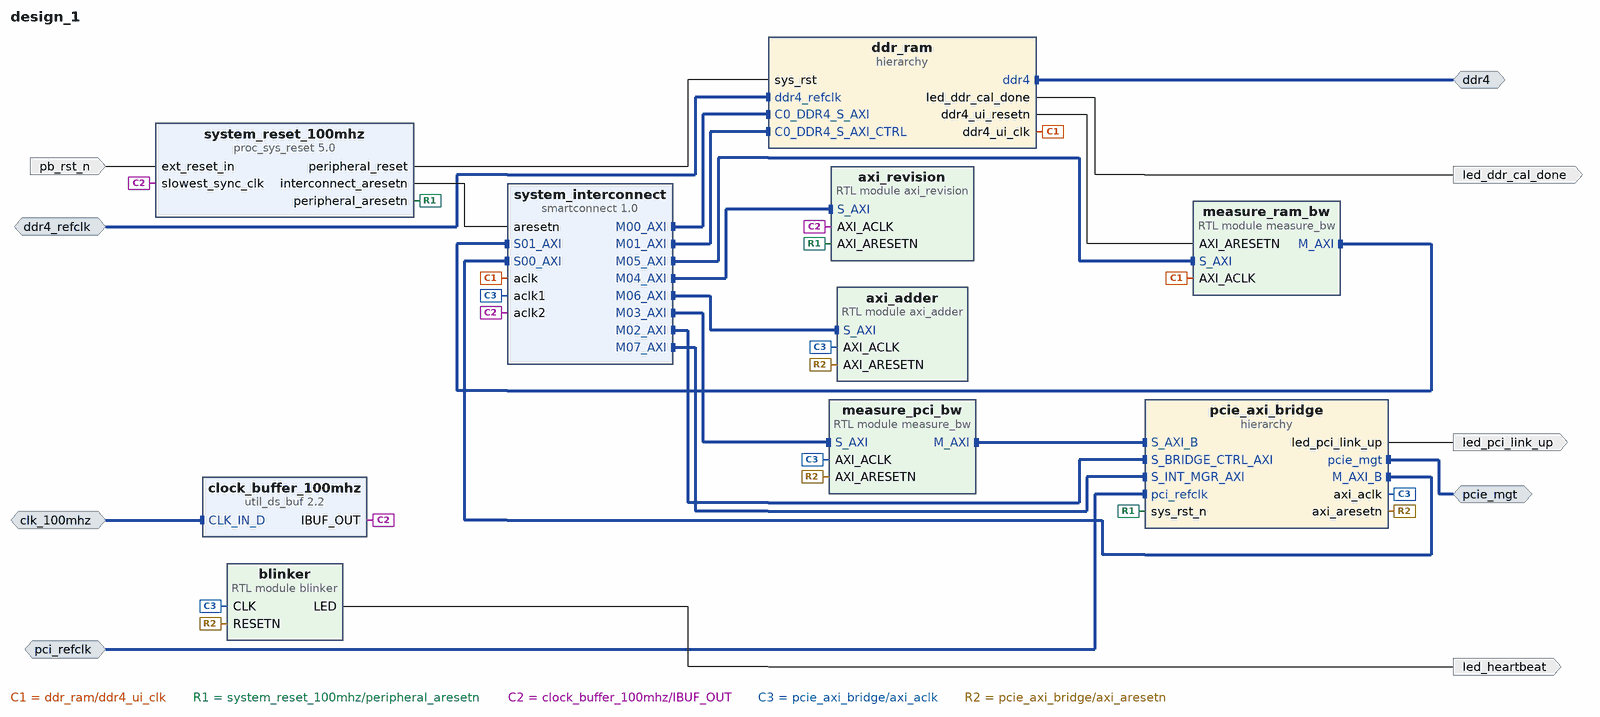
[diagram p0: block diagram of the top level]
# Vivado block design design_1, xczu19eg-ffvc1760-2-i, Vivado 2021.1
create_bd_design design_1

create_bd_intf_port -mode Master -vlnv xilinx.com:interface:ddr4_rtl:1.0 ddr4
create_bd_intf_port -mode Slave -vlnv xilinx.com:interface:diff_clock_rtl:1.0 ddr4_refclk
set_property -dict {CONFIG.FREQ_HZ 333000000} [get_bd_intf_ports ddr4_refclk]
create_bd_intf_port -mode Slave -vlnv xilinx.com:interface:diff_clock_rtl:1.0 clk_100mhz
create_bd_intf_port -mode Slave -vlnv xilinx.com:interface:diff_clock_rtl:1.0 pci_refclk
create_bd_intf_port -mode Master -vlnv xilinx.com:interface:pcie_7x_mgt_rtl:1.0 pcie_mgt
create_bd_port -dir I -type rst pb_rst_n
create_bd_port -dir O led_heartbeat
create_bd_port -dir O led_ddr_cal_done
create_bd_port -dir O led_pci_link_up

create_bd_cell -type ip -vlnv xilinx.com:ip:proc_sys_reset:5.0 system_reset_100mhz
create_bd_cell -type ip -vlnv xilinx.com:ip:util_ds_buf:2.2 clock_buffer_100mhz
create_bd_cell -type module -reference blinker blinker
create_bd_cell -type module -reference axi_revision axi_revision
create_bd_cell -type ip -vlnv xilinx.com:ip:smartconnect:1.0 system_interconnect
set_property -dict {CONFIG.NUM_CLKS 3 CONFIG.NUM_MI 8 CONFIG.NUM_SI 2} [get_bd_cells system_interconnect]
create_bd_cell -type module -reference measure_bw measure_pci_bw
create_bd_cell -type module -reference measure_bw measure_ram_bw
set_property -dict {CONFIG.ADDRESS_OFFSET 0x0000000800000000} [get_bd_cells measure_ram_bw]
create_bd_cell -type module -reference axi_adder axi_adder
create_bd_cell -type hier pcie_axi_bridge
create_bd_cell -type hier ddr_ram

# ---- hierarchy /pcie_axi_bridge ----
current_bd_instance /pcie_axi_bridge
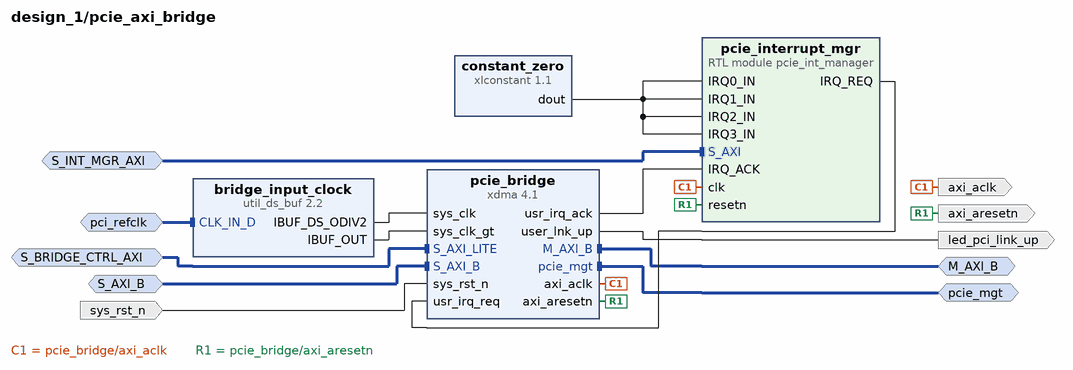
[diagram p1: block diagram inside /pcie_axi_bridge]
create_bd_intf_pin -mode Slave -vlnv xilinx.com:interface:aximm_rtl:1.0 S_BRIDGE_CTRL_AXI
create_bd_intf_pin -mode Slave -vlnv xilinx.com:interface:aximm_rtl:1.0 S_AXI_B
create_bd_intf_pin -mode Master -vlnv xilinx.com:interface:pcie_7x_mgt_rtl:1.0 pcie_mgt
create_bd_intf_pin -mode Master -vlnv xilinx.com:interface:aximm_rtl:1.0 M_AXI_B
create_bd_intf_pin -mode Slave -vlnv xilinx.com:interface:aximm_rtl:1.0 S_INT_MGR_AXI
create_bd_intf_pin -mode Slave -vlnv xilinx.com:interface:diff_clock_rtl:1.0 pci_refclk
create_bd_pin -dir O -type rst axi_aresetn
create_bd_pin -dir O -type clk axi_aclk
create_bd_pin -dir O led_pci_link_up
create_bd_pin -dir I -type rst sys_rst_n

create_bd_cell -type ip -vlnv xilinx.com:ip:xdma:4.1 pcie_bridge
set_property -dict [list \
  CONFIG.PF0_DEVICE_ID_mqdma 903F \
  CONFIG.PF0_SRIOV_VF_DEVICE_ID A03F \
  CONFIG.PF2_DEVICE_ID_mqdma 923F \
  CONFIG.PF3_DEVICE_ID_mqdma 933F \
  CONFIG.axi_addr_width 64 \
  CONFIG.axi_data_width 512_bit \
  CONFIG.axibar2pciebar_0 0x0 \
  CONFIG.axibar_num 1 \
  CONFIG.axilite_master_en true \
  CONFIG.axilite_master_size 8 \
  CONFIG.axisten_freq 250 \
  CONFIG.bridge_burst true \
  CONFIG.c_s_axi_supports_narrow_burst false \
  CONFIG.cfg_mgmt_if false \
  CONFIG.enable_jtag_dbg true \
  CONFIG.functional_mode AXI_Bridge \
  CONFIG.mode_selection Advanced \
  CONFIG.pcie_blk_locn X1Y0 \
  CONFIG.pcie_extended_tag false \
  CONFIG.pciebar2axibar_0 0x00000000 \
  CONFIG.pciebar2axibar_1 0x800000000 \
  CONFIG.pciebar2axibar_axil_master 0A0000000 \
  CONFIG.pf0_Use_Class_Code_Lookup_Assistant false \
  CONFIG.pf0_bar0_64bit false \
  CONFIG.pf0_bar0_scale Megabytes \
  CONFIG.pf0_bar0_size 1 \
  CONFIG.pf0_bar1_enabled true \
  CONFIG.pf0_bar1_scale Megabytes \
  CONFIG.pf0_bar1_size 1 \
  CONFIG.pf0_bar2_enabled false \
  CONFIG.pf0_base_class_menu Simple_communication_controllers \
  CONFIG.pf0_class_code_base 07 \
  CONFIG.pf0_class_code_interface 01 \
  CONFIG.pf0_class_code_sub 00 \
  CONFIG.pf0_device_id 903F \
  CONFIG.pf0_interrupt_pin INTA \
  CONFIG.pf0_msi_enabled false \
  CONFIG.pf0_sub_class_interface_menu 16450_compatible_serial_controller \
  CONFIG.pf0_subsystem_id 0007 \
  CONFIG.pl_link_cap_max_link_speed 8.0_GT/s \
  CONFIG.pl_link_cap_max_link_width X16 \
  CONFIG.plltype QPLL1 \
  CONFIG.xdma_num_usr_irq 1 \
  CONFIG.xdma_sts_ports false \
  CONFIG.xdma_wnum_rids 32 \
] [get_bd_cells pcie_bridge]
create_bd_cell -type ip -vlnv xilinx.com:ip:xlconstant:1.1 constant_zero
set_property -dict {CONFIG.CONST_VAL 0 CONFIG.CONST_WIDTH 1} [get_bd_cells constant_zero]
create_bd_cell -type ip -vlnv xilinx.com:ip:util_ds_buf:2.2 bridge_input_clock
set_property -dict {CONFIG.C_BUF_TYPE IBUFDSGTE} [get_bd_cells bridge_input_clock]
create_bd_cell -type module -reference pcie_int_manager pcie_interrupt_mgr

# ---- hierarchy /ddr_ram ----
current_bd_instance /ddr_ram
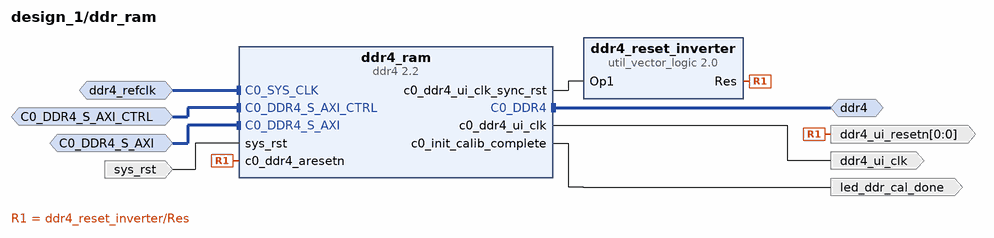
[diagram p2: block diagram inside /ddr_ram]
create_bd_intf_pin -mode Master -vlnv xilinx.com:interface:ddr4_rtl:1.0 ddr4
create_bd_intf_pin -mode Slave -vlnv xilinx.com:interface:diff_clock_rtl:1.0 ddr4_refclk
create_bd_intf_pin -mode Slave -vlnv xilinx.com:interface:aximm_rtl:1.0 C0_DDR4_S_AXI_CTRL
create_bd_intf_pin -mode Slave -vlnv xilinx.com:interface:aximm_rtl:1.0 C0_DDR4_S_AXI
create_bd_pin -dir O led_ddr_cal_done
create_bd_pin -dir O -type clk ddr4_ui_clk
create_bd_pin -dir I -type rst sys_rst
create_bd_pin -dir O -from 0 -to 0 ddr4_ui_resetn

create_bd_cell -type ip -vlnv xilinx.com:ip:ddr4:2.2 ddr4_ram
set_property -dict [list \
  CONFIG.C0.CKE_WIDTH 2 \
  CONFIG.C0.CK_WIDTH 2 \
  CONFIG.C0.CS_WIDTH 2 \
  CONFIG.C0.DDR4_AxiAddressWidth 34 \
  CONFIG.C0.DDR4_AxiDataWidth 512 \
  CONFIG.C0.DDR4_CasLatency 17 \
  CONFIG.C0.DDR4_CasWriteLatency 16 \
  CONFIG.C0.DDR4_CustomParts ../../../../../../ddr4/custom_parts_KSM24SED8.csv \
  CONFIG.C0.DDR4_DataMask NO_DM_NO_DBI \
  CONFIG.C0.DDR4_DataWidth 72 \
  CONFIG.C0.DDR4_InputClockPeriod 3001 \
  CONFIG.C0.DDR4_MemoryPart DDR4_CUSTOM \
  CONFIG.C0.DDR4_MemoryType SODIMMs \
  CONFIG.C0.DDR4_TimePeriod 938 \
  CONFIG.C0.DDR4_isCustom true \
  CONFIG.C0.ODT_WIDTH 2 \
] [get_bd_cells ddr4_ram]
create_bd_cell -type ip -vlnv xilinx.com:ip:util_vector_logic:2.0 ddr4_reset_inverter
set_property -dict {CONFIG.C_OPERATION not CONFIG.C_SIZE 1} [get_bd_cells ddr4_reset_inverter]

# ---- connections ----

current_bd_instance /pcie_axi_bridge
connect_bd_intf_net [get_bd_intf_pins S_BRIDGE_CTRL_AXI] [get_bd_intf_pins pcie_bridge/S_AXI_LITE]
connect_bd_intf_net [get_bd_intf_pins S_AXI_B] [get_bd_intf_pins pcie_bridge/S_AXI_B]
connect_bd_intf_net [get_bd_intf_pins pcie_mgt] [get_bd_intf_pins pcie_bridge/pcie_mgt]
connect_bd_intf_net [get_bd_intf_pins M_AXI_B] [get_bd_intf_pins pcie_bridge/M_AXI_B]
connect_bd_intf_net [get_bd_intf_pins S_INT_MGR_AXI] [get_bd_intf_pins pcie_interrupt_mgr/S_AXI]
connect_bd_intf_net [get_bd_intf_pins pci_refclk] [get_bd_intf_pins bridge_input_clock/CLK_IN_D]
connect_bd_net -net IRQ1_IN_1 [get_bd_pins constant_zero/dout] \
  [get_bd_pins pcie_interrupt_mgr/IRQ0_IN] [get_bd_pins pcie_interrupt_mgr/IRQ1_IN] [get_bd_pins pcie_interrupt_mgr/IRQ2_IN] \
  [get_bd_pins pcie_interrupt_mgr/IRQ3_IN]
connect_bd_net [get_bd_pins bridge_input_clock/IBUF_DS_ODIV2] [get_bd_pins pcie_bridge/sys_clk]
connect_bd_net [get_bd_pins bridge_input_clock/IBUF_OUT] [get_bd_pins pcie_bridge/sys_clk_gt]
connect_bd_net [get_bd_pins pcie_bridge/axi_aclk] [get_bd_pins axi_aclk] [get_bd_pins pcie_interrupt_mgr/clk]
connect_bd_net [get_bd_pins pcie_bridge/axi_aresetn] [get_bd_pins axi_aresetn] [get_bd_pins pcie_interrupt_mgr/resetn]
connect_bd_net [get_bd_pins pcie_bridge/user_lnk_up] [get_bd_pins led_pci_link_up]
connect_bd_net [get_bd_pins pcie_bridge/usr_irq_ack] [get_bd_pins pcie_interrupt_mgr/IRQ_ACK]
connect_bd_net [get_bd_pins pcie_interrupt_mgr/IRQ_REQ] [get_bd_pins pcie_bridge/usr_irq_req]
connect_bd_net [get_bd_pins sys_rst_n] [get_bd_pins pcie_bridge/sys_rst_n]

current_bd_instance /ddr_ram
connect_bd_intf_net [get_bd_intf_pins ddr4] [get_bd_intf_pins ddr4_ram/C0_DDR4]
connect_bd_intf_net [get_bd_intf_pins ddr4_refclk] [get_bd_intf_pins ddr4_ram/C0_SYS_CLK]
connect_bd_intf_net [get_bd_intf_pins C0_DDR4_S_AXI_CTRL] [get_bd_intf_pins ddr4_ram/C0_DDR4_S_AXI_CTRL]
connect_bd_intf_net [get_bd_intf_pins C0_DDR4_S_AXI] [get_bd_intf_pins ddr4_ram/C0_DDR4_S_AXI]
connect_bd_net [get_bd_pins ddr4_ram/c0_ddr4_ui_clk] [get_bd_pins ddr4_ui_clk]
connect_bd_net [get_bd_pins ddr4_ram/c0_ddr4_ui_clk_sync_rst] [get_bd_pins ddr4_reset_inverter/Op1]
connect_bd_net [get_bd_pins ddr4_ram/c0_init_calib_complete] [get_bd_pins led_ddr_cal_done]
connect_bd_net [get_bd_pins ddr4_reset_inverter/Res] [get_bd_pins ddr4_ram/c0_ddr4_aresetn] [get_bd_pins ddr4_ui_resetn]
connect_bd_net [get_bd_pins sys_rst] [get_bd_pins ddr4_ram/sys_rst]

current_bd_instance /
connect_bd_intf_net -intf_net CLK_IN_D_0_1 [get_bd_intf_ports clk_100mhz] [get_bd_intf_pins clock_buffer_100mhz/CLK_IN_D]
connect_bd_intf_net [get_bd_intf_ports ddr4_refclk] [get_bd_intf_pins ddr_ram/ddr4_refclk]
connect_bd_intf_net [get_bd_intf_ports ddr4] [get_bd_intf_pins ddr_ram/ddr4]
connect_bd_intf_net [get_bd_intf_pins measure_pci_bw/M_AXI] [get_bd_intf_pins pcie_axi_bridge/S_AXI_B]
connect_bd_intf_net [get_bd_intf_pins measure_ram_bw/M_AXI] [get_bd_intf_pins system_interconnect/S01_AXI]
connect_bd_intf_net [get_bd_intf_ports pci_refclk] [get_bd_intf_pins pcie_axi_bridge/pci_refclk]
connect_bd_intf_net [get_bd_intf_pins system_interconnect/S00_AXI] [get_bd_intf_pins pcie_axi_bridge/M_AXI_B]
connect_bd_intf_net [get_bd_intf_ports pcie_mgt] [get_bd_intf_pins pcie_axi_bridge/pcie_mgt]
connect_bd_intf_net -intf_net smartconnect_0_M03_AXI [get_bd_intf_pins measure_pci_bw/S_AXI] [get_bd_intf_pins system_interconnect/M03_AXI]
connect_bd_intf_net -intf_net smartconnect_0_M04_AXI [get_bd_intf_pins axi_revision/S_AXI] [get_bd_intf_pins system_interconnect/M04_AXI]
connect_bd_intf_net [get_bd_intf_pins system_interconnect/M00_AXI] [get_bd_intf_pins ddr_ram/C0_DDR4_S_AXI]
connect_bd_intf_net [get_bd_intf_pins system_interconnect/M01_AXI] [get_bd_intf_pins ddr_ram/C0_DDR4_S_AXI_CTRL]
connect_bd_intf_net [get_bd_intf_pins system_interconnect/M02_AXI] [get_bd_intf_pins pcie_axi_bridge/S_BRIDGE_CTRL_AXI]
connect_bd_intf_net [get_bd_intf_pins system_interconnect/M05_AXI] [get_bd_intf_pins measure_ram_bw/S_AXI]
connect_bd_intf_net [get_bd_intf_pins system_interconnect/M06_AXI] [get_bd_intf_pins axi_adder/S_AXI]
connect_bd_intf_net [get_bd_intf_pins system_interconnect/M07_AXI] [get_bd_intf_pins pcie_axi_bridge/S_INT_MGR_AXI]
connect_bd_net -net blinker_0_LED [get_bd_pins blinker/LED] [get_bd_ports led_heartbeat]
connect_bd_net -net ddr4_ram_c0_ddr4_ui_clk [get_bd_pins ddr_ram/ddr4_ui_clk] \
  [get_bd_pins system_interconnect/aclk] [get_bd_pins measure_ram_bw/AXI_ACLK]
connect_bd_net [get_bd_pins ddr_ram/led_ddr_cal_done] [get_bd_ports led_ddr_cal_done]
connect_bd_net -net ext_reset_in_0_1 [get_bd_ports pb_rst_n] [get_bd_pins system_reset_100mhz/ext_reset_in]
connect_bd_net [get_bd_pins pcie_axi_bridge/led_pci_link_up] [get_bd_ports led_pci_link_up]
connect_bd_net [get_bd_pins system_reset_100mhz/interconnect_aresetn] [get_bd_pins system_interconnect/aresetn]
connect_bd_net [get_bd_pins system_reset_100mhz/peripheral_aresetn] [get_bd_pins axi_revision/AXI_ARESETN] [get_bd_pins pcie_axi_bridge/sys_rst_n]
connect_bd_net [get_bd_pins system_reset_100mhz/peripheral_reset] [get_bd_pins ddr_ram/sys_rst]
connect_bd_net -net util_ds_buf_0_IBUF_OUT [get_bd_pins clock_buffer_100mhz/IBUF_OUT] \
  [get_bd_pins system_reset_100mhz/slowest_sync_clk] [get_bd_pins axi_revision/AXI_ACLK] \
  [get_bd_pins system_interconnect/aclk2]
connect_bd_net -net util_vector_logic_0_Res [get_bd_pins ddr_ram/ddr4_ui_resetn] [get_bd_pins measure_ram_bw/AXI_ARESETN]
connect_bd_net -net xdma_0_axi_aclk [get_bd_pins pcie_axi_bridge/axi_aclk] \
  [get_bd_pins blinker/CLK] [get_bd_pins system_interconnect/aclk1] [get_bd_pins measure_pci_bw/AXI_ACLK] \
  [get_bd_pins axi_adder/AXI_ACLK]
connect_bd_net -net xdma_0_axi_aresetn [get_bd_pins pcie_axi_bridge/axi_aresetn] \
  [get_bd_pins blinker/RESETN] [get_bd_pins measure_pci_bw/AXI_ARESETN] [get_bd_pins axi_adder/AXI_ARESETN]

# ---- address map ----
assign_bd_address -offset 0x0000000000000000 -range 16E -target_address_space [get_bd_addr_spaces measure_pci_bw/M_AXI] [get_bd_addr_segs pcie_axi_bridge/pcie_bridge/S_AXI_B/BAR0]
assign_bd_address -offset 0x0000000000000000 -range 4K -target_address_space [get_bd_addr_spaces measure_ram_bw/M_AXI] [get_bd_addr_segs axi_revision/S_AXI/reg0]
assign_bd_address -offset 0x0000000000001000 -range 4K -target_address_space [get_bd_addr_spaces measure_ram_bw/M_AXI] [get_bd_addr_segs measure_pci_bw/S_AXI/reg0]
assign_bd_address -offset 0x0000000000002000 -range 4K -target_address_space [get_bd_addr_spaces measure_ram_bw/M_AXI] [get_bd_addr_segs measure_ram_bw/S_AXI/reg0]
assign_bd_address -offset 0x0000000000003000 -range 4K -target_address_space [get_bd_addr_spaces measure_ram_bw/M_AXI] [get_bd_addr_segs axi_adder/S_AXI/reg0]
assign_bd_address -offset 0x0000000000004000 -range 4K -target_address_space [get_bd_addr_spaces measure_ram_bw/M_AXI] [get_bd_addr_segs pcie_axi_bridge/pcie_interrupt_mgr/S_AXI/reg0]
assign_bd_address -offset 0x0000000000008000 -range 4K -target_address_space [get_bd_addr_spaces measure_ram_bw/M_AXI] [get_bd_addr_segs ddr_ram/ddr4_ram/C0_DDR4_MEMORY_MAP_CTRL/C0_REG]
assign_bd_address -offset 0x0000000000009000 -range 4K -target_address_space [get_bd_addr_spaces measure_ram_bw/M_AXI] [get_bd_addr_segs pcie_axi_bridge/pcie_bridge/S_AXI_LITE/CTL0]
assign_bd_address -offset 0x0000000800000000 -range 16G -target_address_space [get_bd_addr_spaces measure_ram_bw/M_AXI] [get_bd_addr_segs ddr_ram/ddr4_ram/C0_DDR4_MEMORY_MAP/C0_DDR4_ADDRESS_BLOCK]
assign_bd_address -offset 0x0000000000000000 -range 4K -target_address_space [get_bd_addr_spaces pcie_axi_bridge/pcie_bridge/M_AXI_B] [get_bd_addr_segs axi_revision/S_AXI/reg0]
assign_bd_address -offset 0x0000000000001000 -range 4K -target_address_space [get_bd_addr_spaces pcie_axi_bridge/pcie_bridge/M_AXI_B] [get_bd_addr_segs measure_pci_bw/S_AXI/reg0]
assign_bd_address -offset 0x0000000000002000 -range 4K -target_address_space [get_bd_addr_spaces pcie_axi_bridge/pcie_bridge/M_AXI_B] [get_bd_addr_segs measure_ram_bw/S_AXI/reg0]
assign_bd_address -offset 0x0000000000003000 -range 4K -target_address_space [get_bd_addr_spaces pcie_axi_bridge/pcie_bridge/M_AXI_B] [get_bd_addr_segs axi_adder/S_AXI/reg0]
assign_bd_address -offset 0x0000000000004000 -range 4K -target_address_space [get_bd_addr_spaces pcie_axi_bridge/pcie_bridge/M_AXI_B] [get_bd_addr_segs pcie_axi_bridge/pcie_interrupt_mgr/S_AXI/reg0]
assign_bd_address -offset 0x0000000000008000 -range 4K -target_address_space [get_bd_addr_spaces pcie_axi_bridge/pcie_bridge/M_AXI_B] [get_bd_addr_segs ddr_ram/ddr4_ram/C0_DDR4_MEMORY_MAP_CTRL/C0_REG]
assign_bd_address -offset 0x0000000000009000 -range 4K -target_address_space [get_bd_addr_spaces pcie_axi_bridge/pcie_bridge/M_AXI_B] [get_bd_addr_segs pcie_axi_bridge/pcie_bridge/S_AXI_LITE/CTL0]
assign_bd_address -offset 0x0000000800000000 -range 16G -target_address_space [get_bd_addr_spaces pcie_axi_bridge/pcie_bridge/M_AXI_B] [get_bd_addr_segs ddr_ram/ddr4_ram/C0_DDR4_MEMORY_MAP/C0_DDR4_ADDRESS_BLOCK]

validate_bd_design
save_bd_design
